# EAGLE schematic ife_19_Accumulator_BMS_v1 (EAGLE 9.0.1)

## Sheet 1 of 5: Power
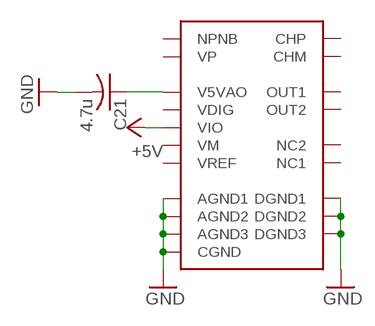
[diagram p0: schematic, sheet 1]

### Parts
C21  4.7u  C-USC0805  [C0805]
U$1  BQ76PL455A  [TQFP80]

### Nets
+5V: U$1.41(VIO) ; also sheet 4,5
GND: C21.2 U$1.30(DGND1) U$1.35(DGND2) U$1.37(DGND3) U$1.48(CGND) U$1.69(AGND3) U$1.72(AGND2) U$1.74(AGND1) ; also sheet 2,3,4,5
N$39: C21.1 U$1.58(V5VAO)
Unconnected: U$1.31(VM) U$1.32(CHP) U$1.33(CHM) U$1.34(VDIG) U$1.36(NC1) U$1.67(VREF) U$1.68(OUT2) U$1.70(VP) U$1.71(NPNB) U$1.73(OUT1) U$1.75(NC2)

## Sheet 2 of 5: Cells
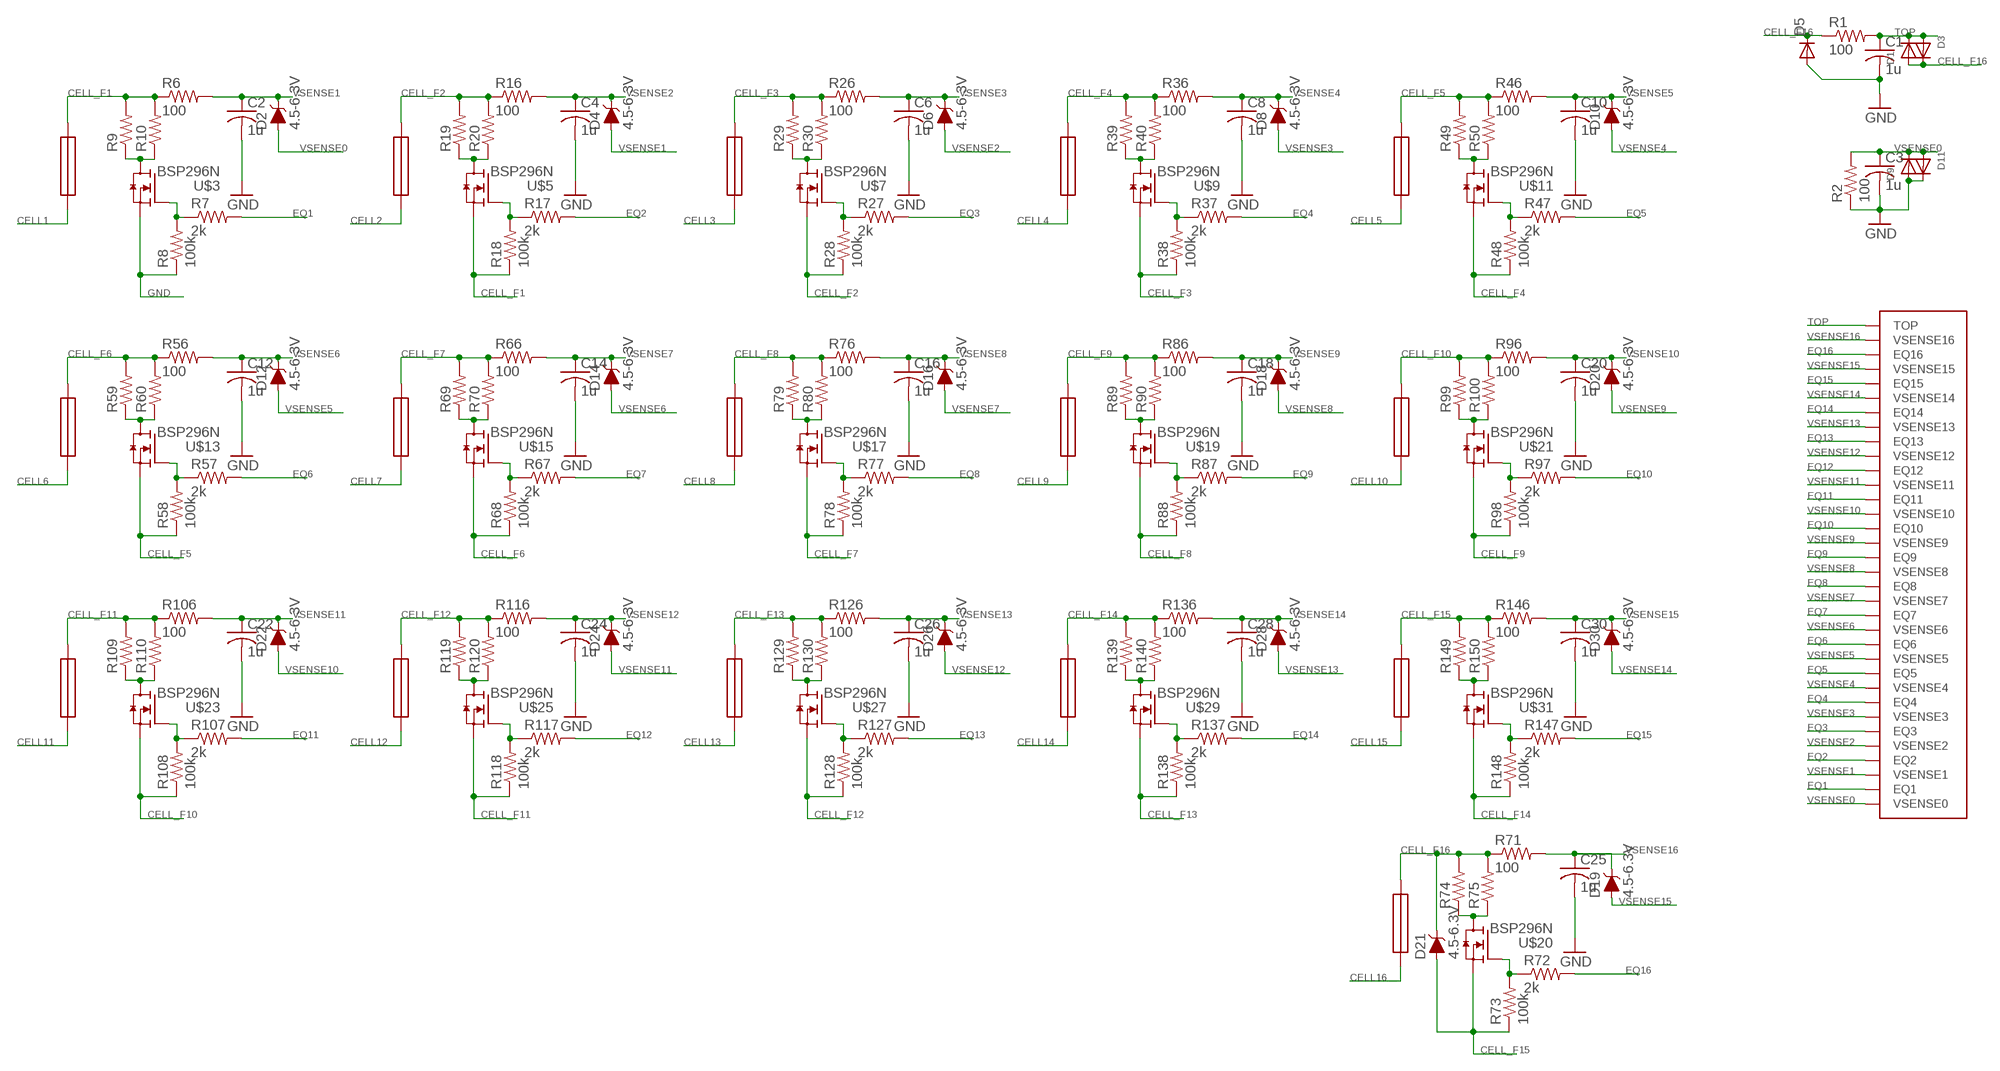
[diagram p1: schematic, sheet 2]

### Parts
C1  1u  C-USC0603K  [C0603K]
C2  1u  C-USC0603K  [C0603K]
C3  1u  C-USC0603K  [C0603K]
C4  1u  C-USC0603K  [C0603K]
C6  1u  C-USC0603K  [C0603K]
C8  1u  C-USC0603K  [C0603K]
C10  1u  C-USC0603K  [C0603K]
C12  1u  C-USC0603K  [C0603K]
C14  1u  C-USC0603K  [C0603K]
C16  1u  C-USC0603K  [C0603K]
C18  1u  C-USC0603K  [C0603K]
C20  1u  C-USC0603K  [C0603K]
C22  1u  C-USC0603K  [C0603K]
C24  1u  C-USC0603K  [C0603K]
C25  1u  C-USC0603K  [C0603K]
C26  1u  C-USC0603K  [C0603K]
C28  1u  C-USC0603K  [C0603K]
C30  1u  C-USC0603K  [C0603K]
D1  DIODESOD-123  [SOD-123]
D2  4.5-6.3V  DIODE-ZENER-MMSZ5232BS  [SOD-323]
D3  DIODESOD-123  [SOD-123]
D4  4.5-6.3V  DIODE-ZENER-MMSZ5232BS  [SOD-323]
D5  DIODE-DO214AC  [DO214AC]
D6  4.5-6.3V  DIODE-ZENER-MMSZ5232BS  [SOD-323]
D8  4.5-6.3V  DIODE-ZENER-MMSZ5232BS  [SOD-323]
D9  DIODESOD-123  [SOD-123]
D10  4.5-6.3V  DIODE-ZENER-MMSZ5232BS  [SOD-323]
D11  DIODESOD-123  [SOD-123]
D12  4.5-6.3V  DIODE-ZENER-MMSZ5232BS  [SOD-323]
D14  4.5-6.3V  DIODE-ZENER-MMSZ5232BS  [SOD-323]
D16  4.5-6.3V  DIODE-ZENER-MMSZ5232BS  [SOD-323]
D18  4.5-6.3V  DIODE-ZENER-MMSZ5232BS  [SOD-323]
D19  4.5-6.3V  DIODE-ZENER-MMSZ5232BS  [SOD-323]
D20  4.5-6.3V  DIODE-ZENER-MMSZ5232BS  [SOD-323]
D21  4.5-6.3V  DIODE-ZENER-MMSZ5232BS  [SOD-323]
D22  4.5-6.3V  DIODE-ZENER-MMSZ5232BS  [SOD-323]
D24  4.5-6.3V  DIODE-ZENER-MMSZ5232BS  [SOD-323]
D26  4.5-6.3V  DIODE-ZENER-MMSZ5232BS  [SOD-323]
D28  4.5-6.3V  DIODE-ZENER-MMSZ5232BS  [SOD-323]
D30  4.5-6.3V  DIODE-ZENER-MMSZ5232BS  [SOD-323]
FUSE1  2A  SSQC/SSTC  [0.36"X0.15"]
FUSE2  2A  SSQC/SSTC  [0.36"X0.15"]
FUSE3  2A  SSQC/SSTC  [0.36"X0.15"]
FUSE5  2A  SSQC/SSTC  [0.36"X0.15"]
FUSE7  2A  SSQC/SSTC  [0.36"X0.15"]
FUSE9  2A  SSQC/SSTC  [0.36"X0.15"]
FUSE11  2A  SSQC/SSTC  [0.36"X0.15"]
FUSE13  2A  SSQC/SSTC  [0.36"X0.15"]
FUSE15  2A  SSQC/SSTC  [0.36"X0.15"]
FUSE17  2A  SSQC/SSTC  [0.36"X0.15"]
FUSE19  2A  SSQC/SSTC  [0.36"X0.15"]
FUSE21  2A  SSQC/SSTC  [0.36"X0.15"]
FUSE23  2A  SSQC/SSTC  [0.36"X0.15"]
FUSE25  2A  SSQC/SSTC  [0.36"X0.15"]
FUSE27  2A  SSQC/SSTC  [0.36"X0.15"]
FUSE29  2A  SSQC/SSTC  [0.36"X0.15"]
R1  100  R-US_R0603  [R0603]
R2  100  R-US_R0603  [R0603]
R6  100  R-US_R0603  [R0603]
R7  2k  R-US_R0603  [R0603]
R8  100k  R-US_R0603  [R0603]
R9  R-US_R2512  [R2512]
R10  R-US_R2512  [R2512]
R16  100  R-US_R0603  [R0603]
R17  2k  R-US_R0603  [R0603]
R18  100k  R-US_R0603  [R0603]
R19  R-US_R2512  [R2512]
R20  R-US_R2512  [R2512]
R26  100  R-US_R0603  [R0603]
R27  2k  R-US_R0603  [R0603]
R28  100k  R-US_R0603  [R0603]
R29  R-US_R2512  [R2512]
R30  R-US_R2512  [R2512]
R36  100  R-US_R0603  [R0603]
R37  2k  R-US_R0603  [R0603]
R38  100k  R-US_R0603  [R0603]
R39  R-US_R2512  [R2512]
R40  R-US_R2512  [R2512]
R46  100  R-US_R0603  [R0603]
R47  2k  R-US_R0603  [R0603]
R48  100k  R-US_R0603  [R0603]
R49  R-US_R2512  [R2512]
R50  R-US_R2512  [R2512]
R56  100  R-US_R0603  [R0603]
R57  2k  R-US_R0603  [R0603]
R58  100k  R-US_R0603  [R0603]
R59  R-US_R2512  [R2512]
R60  R-US_R2512  [R2512]
R66  100  R-US_R0603  [R0603]
R67  2k  R-US_R0603  [R0603]
R68  100k  R-US_R0603  [R0603]
R69  R-US_R2512  [R2512]
R70  R-US_R2512  [R2512]
R71  100  R-US_R0603  [R0603]
R72  2k  R-US_R0603  [R0603]
R73  100k  R-US_R0603  [R0603]
R74  R-US_R2512  [R2512]
R75  R-US_R2512  [R2512]
R76  100  R-US_R0603  [R0603]
R77  2k  R-US_R0603  [R0603]
R78  100k  R-US_R0603  [R0603]
R79  R-US_R2512  [R2512]
R80  R-US_R2512  [R2512]
R86  100  R-US_R0603  [R0603]
R87  2k  R-US_R0603  [R0603]
R88  100k  R-US_R0603  [R0603]
R89  R-US_R2512  [R2512]
R90  R-US_R2512  [R2512]
R96  100  R-US_R0603  [R0603]
R97  2k  R-US_R0603  [R0603]
R98  100k  R-US_R0603  [R0603]
R99  R-US_R2512  [R2512]
R100  R-US_R2512  [R2512]
R106  100  R-US_R0603  [R0603]
R107  2k  R-US_R0603  [R0603]
R108  100k  R-US_R0603  [R0603]
R109  R-US_R2512  [R2512]
R110  R-US_R2512  [R2512]
R116  100  R-US_R0603  [R0603]
R117  2k  R-US_R0603  [R0603]
R118  100k  R-US_R0603  [R0603]
R119  R-US_R2512  [R2512]
R120  R-US_R2512  [R2512]
R126  100  R-US_R0603  [R0603]
R127  2k  R-US_R0603  [R0603]
R128  100k  R-US_R0603  [R0603]
R129  R-US_R2512  [R2512]
R130  R-US_R2512  [R2512]
R136  100  R-US_R0603  [R0603]
R137  2k  R-US_R0603  [R0603]
R138  100k  R-US_R0603  [R0603]
R139  R-US_R2512  [R2512]
R140  R-US_R2512  [R2512]
R146  100  R-US_R0603  [R0603]
R147  2k  R-US_R0603  [R0603]
R148  100k  R-US_R0603  [R0603]
R149  R-US_R2512  [R2512]
R150  R-US_R2512  [R2512]
U$3  BSP296N  [PG-SOT-223]
U$5  BSP296N  [PG-SOT-223]
U$7  BSP296N  [PG-SOT-223]
U$9  BSP296N  [PG-SOT-223]
U$11  BSP296N  [PG-SOT-223]
U$13  BSP296N  [PG-SOT-223]
U$15  BSP296N  [PG-SOT-223]
U$17  BSP296N  [PG-SOT-223]
U$19  BSP296N  [PG-SOT-223]
U$20  BSP296N  [PG-SOT-223]
U$21  BSP296N  [PG-SOT-223]
U$23  BSP296N  [PG-SOT-223]
U$25  BSP296N  [PG-SOT-223]
U$27  BSP296N  [PG-SOT-223]
U$29  BSP296N  [PG-SOT-223]
U$31  BSP296N  [PG-SOT-223]

### Nets
CELL1: FUSE1.P$1
CELL2: FUSE3.P$1
CELL3: FUSE5.P$1
CELL4: FUSE7.P$1
CELL5: FUSE9.P$1
CELL6: FUSE11.P$1
CELL7: FUSE13.P$1
CELL8: FUSE15.P$1
CELL9: FUSE17.P$1
CELL10: FUSE19.P$1
CELL11: FUSE21.P$1
CELL12: FUSE23.P$1
CELL13: FUSE25.P$1
CELL14: FUSE27.P$1
CELL15: FUSE29.P$1
CELL16: FUSE2.P$1
CELL_F1: FUSE1.P$2 R6.1 R9.2 R10.2 R18.1 U$5.3(S)
CELL_F2: FUSE3.P$2 R16.1 R19.2 R20.2 R28.1 U$7.3(S)
CELL_F3: FUSE5.P$2 R26.1 R29.2 R30.2 R38.1 U$9.3(S)
CELL_F4: FUSE7.P$2 R36.1 R39.2 R40.2 R48.1 U$11.3(S)
CELL_F5: FUSE9.P$2 R46.1 R49.2 R50.2 R58.1 U$13.3(S)
CELL_F6: FUSE11.P$2 R56.1 R59.2 R60.2 R68.1 U$15.3(S)
CELL_F7: FUSE13.P$2 R66.1 R69.2 R70.2 R78.1 U$17.3(S)
CELL_F8: FUSE15.P$2 R76.1 R79.2 R80.2 R88.1 U$19.3(S)
CELL_F9: FUSE17.P$2 R86.1 R89.2 R90.2 R98.1 U$21.3(S)
CELL_F10: FUSE19.P$2 R96.1 R99.2 R100.2 R108.1 U$23.3(S)
CELL_F11: FUSE21.P$2 R106.1 R109.2 R110.2 R118.1 U$25.3(S)
CELL_F12: FUSE23.P$2 R116.1 R119.2 R120.2 R128.1 U$27.3(S)
CELL_F13: FUSE25.P$2 R126.1 R129.2 R130.2 R138.1 U$29.3(S)
CELL_F14: FUSE27.P$2 R136.1 R139.2 R140.2 R148.1 U$31.3(S)
CELL_F15: D21.A FUSE29.P$2 R73.1 R146.1 R149.2 R150.2 U$20.3(S)
CELL_F16: D1.A D3.C D5.C D21.C FUSE2.P$2 R1.1 R71.1 R74.2 R75.2
EQ1: R7.2 U$1.28(EQ1)
EQ2: R17.2 U$1.26(EQ2)
EQ3: R27.2 U$1.24(EQ3)
EQ4: R37.2 U$1.22(EQ4)
EQ5: R47.2 U$1.20(EQ5)
EQ6: R57.2 U$1.18(EQ6)
EQ7: R67.2 U$1.16(EQ7)
EQ8: R77.2 U$1.14(EQ8)
EQ9: R87.2 U$1.12(EQ9)
EQ10: R97.2 U$1.10(EQ10)
EQ11: R107.2 U$1.8(EQ11)
EQ12: R117.2 U$1.6(EQ12)
EQ13: R127.2 U$1.4(EQ13)
EQ14: R137.2 U$1.2(EQ14)
EQ15: R147.2 U$1.80(EQ15)
EQ16: R72.2 U$1.78(EQ16)
GATE1: R7.1 R8.2 U$3.1(G)
GATE2: R17.1 R18.2 U$5.1(G)
GATE3: R27.1 R28.2 U$7.1(G)
GATE4: R37.1 R38.2 U$9.1(G)
GATE5: R47.1 R48.2 U$11.1(G)
GATE6: R57.1 R58.2 U$13.1(G)
GATE7: R67.1 R68.2 U$15.1(G)
GATE8: R77.1 R78.2 U$17.1(G)
GATE9: R87.1 R88.2 U$19.1(G)
GATE10: R97.1 R98.2 U$21.1(G)
GATE11: R107.1 R108.2 U$23.1(G)
GATE12: R117.1 R118.2 U$25.1(G)
GATE13: R127.1 R128.2 U$27.1(G)
GATE14: R137.1 R138.2 U$29.1(G)
GATE15: R147.1 R148.2 U$31.1(G)
GATE16: R72.1 R73.2 U$20.1(G)
GND: C1.2 C2.2 C3.2 C4.2 C6.2 C8.2 C10.2 C12.2 C14.2 C16.2 C18.2 C20.2 C22.2 C24.2 C25.2 C26.2 C28.2 C30.2 D5.A D9.A D11.C R2.1 R8.1 U$3.3(S) ; also sheet 1,3,4,5
N$32: R9.1 R10.1 U$3.2(D) U$3.4(D)
N$34: R19.1 R20.1 U$5.2(D) U$5.4(D)
N$36: R29.1 R30.1 U$7.2(D) U$7.4(D)
N$38: R39.1 R40.1 U$9.2(D) U$9.4(D)
N$40: R49.1 R50.1 U$11.2(D) U$11.4(D)
N$42: R59.1 R60.1 U$13.2(D) U$13.4(D)
N$43: R74.1 R75.1 U$20.2(D) U$20.4(D)
N$44: R69.1 R70.1 U$15.2(D) U$15.4(D)
N$47: R79.1 R80.1 U$17.2(D) U$17.4(D)
N$50: R89.1 R90.1 U$19.2(D) U$19.4(D)
N$54: R99.1 R100.1 U$21.2(D) U$21.4(D)
N$58: R109.1 R110.1 U$23.2(D) U$23.4(D)
N$62: R119.1 R120.1 U$25.2(D) U$25.4(D)
N$66: R129.1 R130.1 U$27.2(D) U$27.4(D)
N$70: R139.1 R140.1 U$29.2(D) U$29.4(D)
N$74: R149.1 R150.1 U$31.2(D) U$31.4(D)
TOP: C1.1 D1.C D3.A R1.2 U$1.76(TOP)
VSENSE0: C3.1 D2.A D9.C D11.A R2.2 U$1.29(VSENSE0)
VSENSE1: C2.1 D2.C D4.A R6.2 U$1.27(VSENSE1)
VSENSE2: C4.1 D4.C D6.A R16.2 U$1.25(VSENSE2)
VSENSE3: C6.1 D6.C D8.A R26.2 U$1.23(VSENSE3)
VSENSE4: C8.1 D8.C D10.A R36.2 U$1.21(VSENSE4)
VSENSE5: C10.1 D10.C D12.A R46.2 U$1.19(VSENSE5)
VSENSE6: C12.1 D12.C D14.A R56.2 U$1.17(VSENSE6)
VSENSE7: C14.1 D14.C D16.A R66.2 U$1.15(VSENSE7)
VSENSE8: C16.1 D16.C D18.A R76.2 U$1.13(VSENSE8)
VSENSE9: C18.1 D18.C D20.A R86.2 U$1.11(VSENSE9)
VSENSE10: C20.1 D20.C D22.A R96.2 U$1.9(VSENSE10)
VSENSE11: C22.1 D22.C D24.A R106.2 U$1.7(VSENSE11)
VSENSE12: C24.1 D24.C D26.A R116.2 U$1.5(VSENSE12)
VSENSE13: C26.1 D26.C D28.A R126.2 U$1.3(VSENSE13)
VSENSE14: C28.1 D28.C D30.A R136.2 U$1.1(VSENSE14)
VSENSE15: C30.1 D19.A D30.C R146.2 U$1.79(VSENSE15)
VSENSE16: C25.1 D19.C R71.2 U$1.77(VSENSE16)

## Sheet 3 of 5: Differential communication
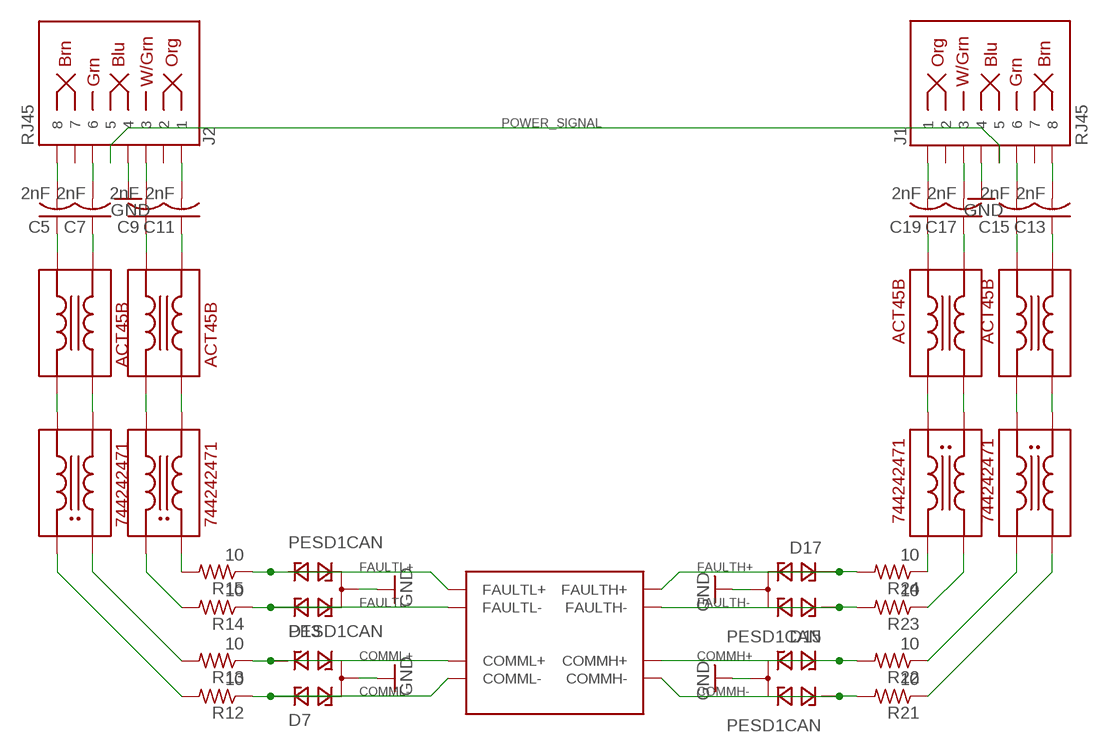
[diagram p2: schematic, sheet 3]

### Parts
C5  2nF  C-USC0805  [C0805]
C7  2nF  C-USC0805  [C0805]
C9  2nF  C-USC0805  [C0805]
C11  2nF  C-USC0805  [C0805]
C13  2nF  C-USC0805  [C0805]
C15  2nF  C-USC0805  [C0805]
C17  2nF  C-USC0805  [C0805]
C19  2nF  C-USC0805  [C0805]
D7  PESD1CAN  [SOT23]
D13  PESD1CAN  [SOT23]
D15  PESD1CAN  [SOT23]
D17  PESD1CAN  [SOT23]
J1  RJ45  RJ45-8  [RJ45-8]
J2  RJ45  RJ45-8  [RJ45-8]
R12  10  R-US_R0805  [R0805]
R13  10  R-US_R0805  [R0805]
R14  10  R-US_R0805  [R0805]
R15  10  R-US_R0805  [R0805]
R21  10  R-US_R0805  [R0805]
R22  10  R-US_R0805  [R0805]
R23  10  R-US_R0805  [R0805]
R24  10  R-US_R0805  [R0805]
U$2  ACT45B  [1812-4]
U$4  ACT45B  [1812-4]
U$6  ACT45B  [1812-4]
U$8  ACT45B  [1812-4]
U$10  WURTH-744242471  [744242471]
U$12  WURTH-744242471  [744242471]
U$14  WURTH-744242471  [744242471]
U$16  WURTH-744242471  [744242471]

### Nets
COMMH+: D15.1 R22.2 U$1.55(COMMH+)
COMMH-: D15.2 R21.2 U$1.54(COMMH-)
COMML+: D7.2 R13.1 U$1.52(COMML+)
COMML-: D7.1 R12.1 U$1.53(COMML-)
FAULTH+: D17.1 R24.2 U$1.57(FAULTH+)
FAULTH-: D17.2 R23.2 U$1.56(FAULTH-)
FAULTL+: D13.2 R15.1 U$1.50(FAULTL+)
FAULTL-: D13.1 R14.1 U$1.51(FAULTL-)
GND: D7.3 D13.3 D15.3 D17.3 J1.4 J2.4 ; also sheet 1,2,4,5
N$1: C5.1 U$6.P$4
N$2: C7.1 U$6.P$3
N$3: C9.1 U$8.P$4
N$4: C11.1 U$8.P$3
N$7: C13.1 U$2.P$2
N$8: C15.1 U$2.P$1
N$9: C17.1 U$4.P$2
N$10: C19.1 U$4.P$1
N$11: U$2.P$3 U$14.2
N$12: U$2.P$4 U$14.1
N$13: U$4.P$3 U$16.2
N$14: U$4.P$4 U$16.1
N$15: U$6.P$1 U$10.3
N$16: U$6.P$2 U$10.4
N$17: U$8.P$1 U$12.3
N$18: U$8.P$2 U$12.4
N$19: R14.2 U$12.1
N$20: R13.2 U$10.2
N$21: R12.2 U$10.1
N$22: R15.2 U$12.2
N$23: R23.1 U$16.4
N$24: R22.1 U$14.3
N$25: R21.1 U$14.4
N$26: R24.1 U$16.3
N$27: C5.2 J2.8
N$28: C7.2 J2.6
N$29: C9.2 J2.3
N$30: C11.2 J2.1
N$31: C13.2 J1.8
N$33: C15.2 J1.6
N$35: C17.2 J1.3
N$37: C19.2 J1.1
POWER_SIGNAL: J1.5 J2.5
Unconnected: J1.2 J1.7 J2.2 J2.7

## Sheet 4 of 5: Communication
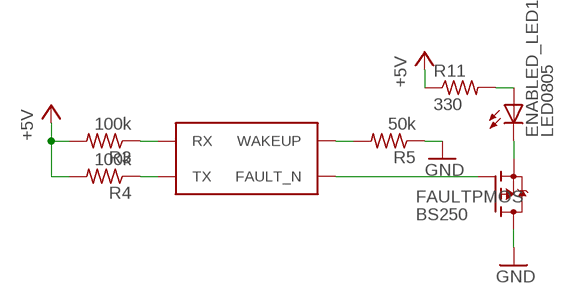
[diagram p3: schematic, sheet 4]

### Parts
ENABLED_LED1  LED0805  [LED0805]
FAULTPMOS  BS250  [SOT23]
R3  100k  R-US_R0805  [R0805]
R4  100k  R-US_R0805  [R0805]
R5  50k  R-US_R0805  [R0805]
R11  330  R-US_R0805  [R0805]

### Nets
+5V: R3.2 R4.2 R11.1 ; also sheet 1,5
FAULT_N: FAULTPMOS.1(G) U$1.40(FAULT_N)
GND: FAULTPMOS.3(D) R5.1 ; also sheet 1,2,3,5
N$5: ENABLED_LED1.2(C) FAULTPMOS.2(S)
N$6: ENABLED_LED1.1(A) R11.2
RX: R3.1 U$1.39(RX)
TX: R4.1 U$1.38(TX)
WAKEUP: R5.2 U$1.49(WAKEUP)

## Sheet 5 of 5: GPIO
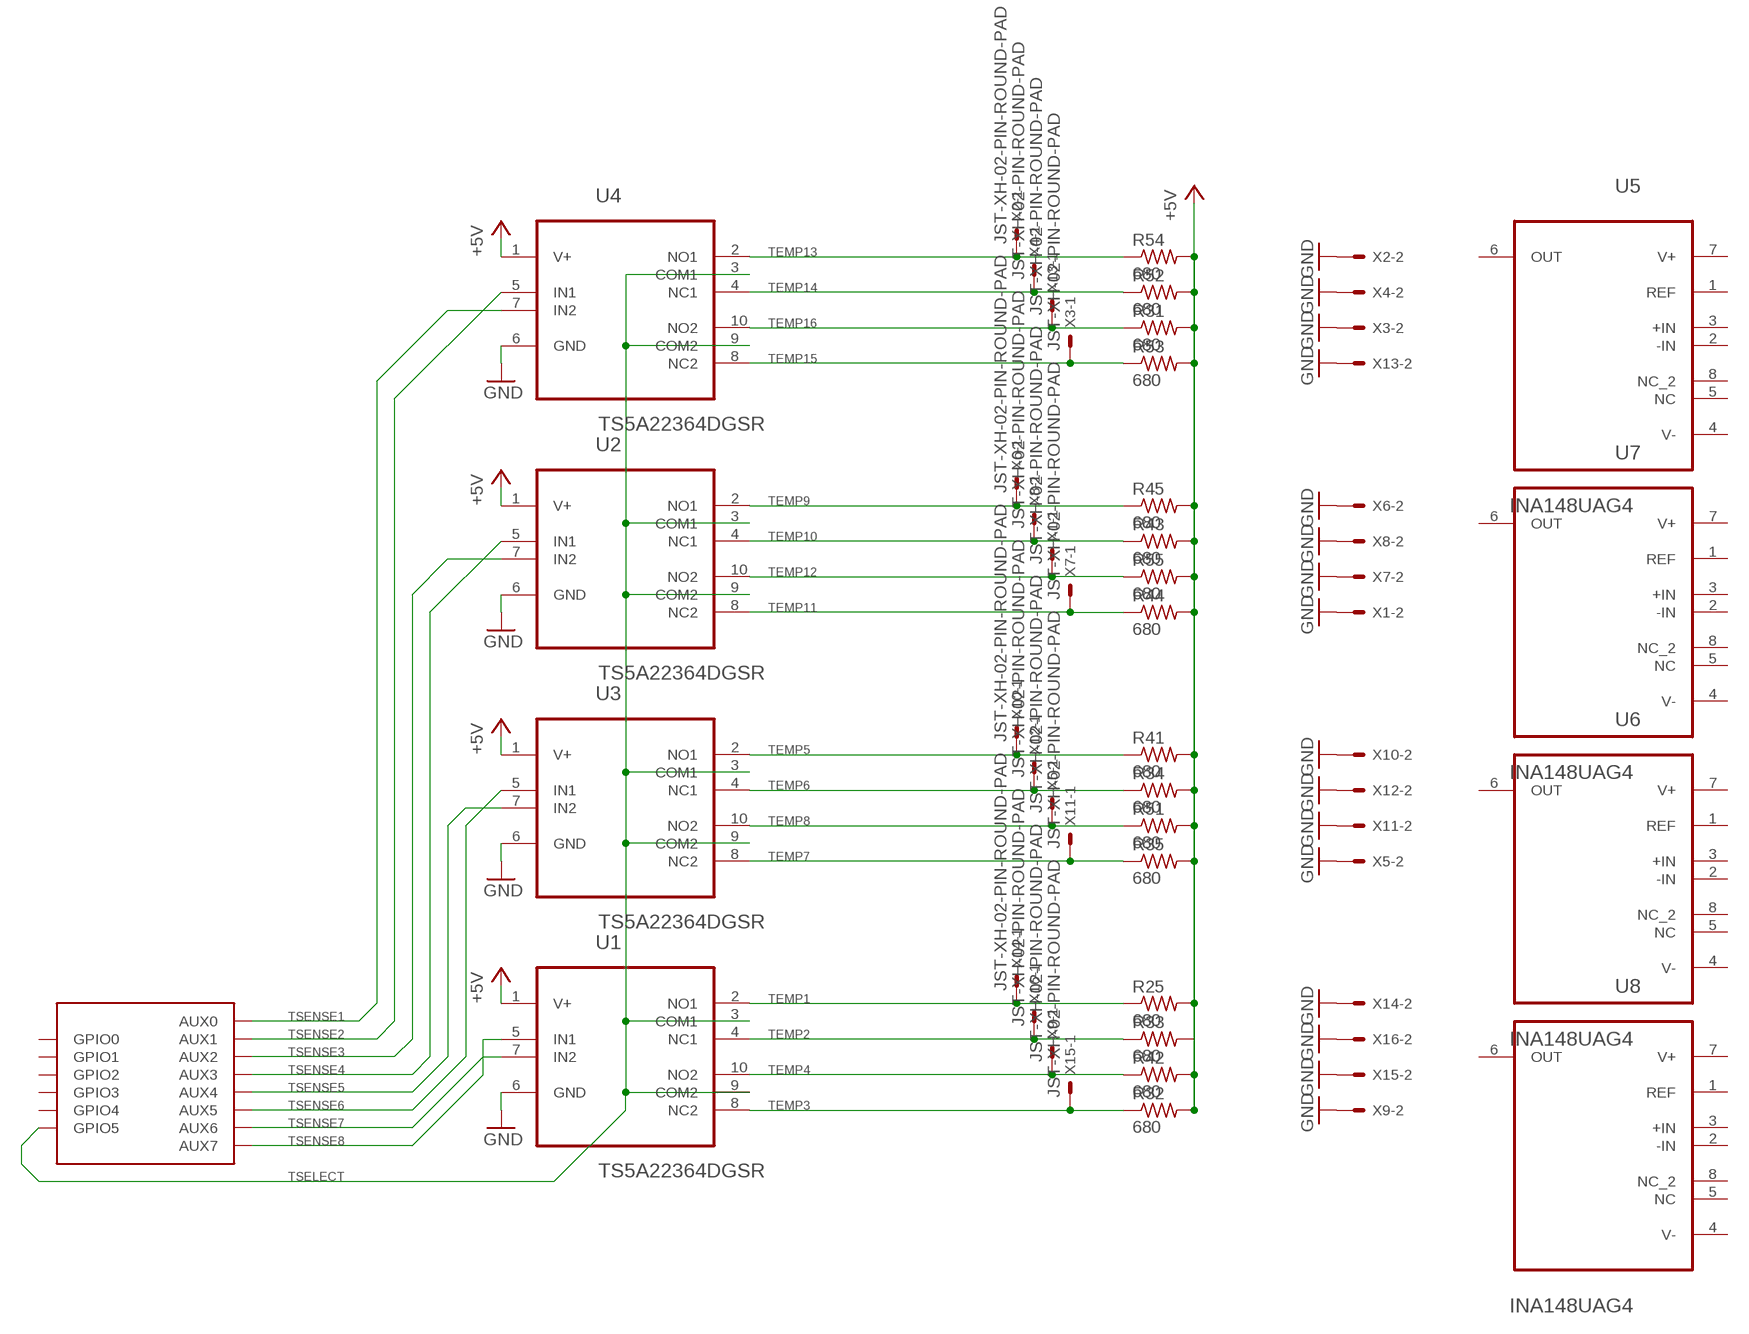
[diagram p4: schematic, sheet 5]

### Parts
R25  680  R-US_R0805  [R0805]
R31  680  R-US_R0805  [R0805]
R32  680  R-US_R0805  [R0805]
R33  680  R-US_R0805  [R0805]
R34  680  R-US_R0805  [R0805]
R35  680  R-US_R0805  [R0805]
R41  680  R-US_R0805  [R0805]
R42  680  R-US_R0805  [R0805]
R43  680  R-US_R0805  [R0805]
R44  680  R-US_R0805  [R0805]
R45  680  R-US_R0805  [R0805]
R51  680  R-US_R0805  [R0805]
R52  680  R-US_R0805  [R0805]
R53  680  R-US_R0805  [R0805]
R54  680  R-US_R0805  [R0805]
R55  680  R-US_R0805  [R0805]
U1  TS5A22364DGSR  [SOP50P490X110-10N]
U2  TS5A22364DGSR  [SOP50P490X110-10N]
U3  TS5A22364DGSR  [SOP50P490X110-10N]
U4  TS5A22364DGSR  [SOP50P490X110-10N]
U5  INA148UAG4  [SOIC127P600X175-8N]
U6  INA148UAG4  [SOIC127P600X175-8N]
U7  INA148UAG4  [SOIC127P600X175-8N]
U8  INA148UAG4  [SOIC127P600X175-8N]
X1  JST-XH-02-PIN-ROUND-PAD  [JST-XH-02-PACKAGE-ROUND-PAD]
X2  JST-XH-02-PIN-ROUND-PAD  [JST-XH-02-PACKAGE-ROUND-PAD]
X3  JST-XH-02-PIN-ROUND-PAD  [JST-XH-02-PACKAGE-ROUND-PAD]
X4  JST-XH-02-PIN-ROUND-PAD  [JST-XH-02-PACKAGE-ROUND-PAD]
X5  JST-XH-02-PIN-ROUND-PAD  [JST-XH-02-PACKAGE-ROUND-PAD]
X6  JST-XH-02-PIN-ROUND-PAD  [JST-XH-02-PACKAGE-ROUND-PAD]
X7  JST-XH-02-PIN-ROUND-PAD  [JST-XH-02-PACKAGE-ROUND-PAD]
X8  JST-XH-02-PIN-ROUND-PAD  [JST-XH-02-PACKAGE-ROUND-PAD]
X9  JST-XH-02-PIN-ROUND-PAD  [JST-XH-02-PACKAGE-ROUND-PAD]
X10  JST-XH-02-PIN-ROUND-PAD  [JST-XH-02-PACKAGE-ROUND-PAD]
X11  JST-XH-02-PIN-ROUND-PAD  [JST-XH-02-PACKAGE-ROUND-PAD]
X12  JST-XH-02-PIN-ROUND-PAD  [JST-XH-02-PACKAGE-ROUND-PAD]
X13  JST-XH-02-PIN-ROUND-PAD  [JST-XH-02-PACKAGE-ROUND-PAD]
X14  JST-XH-02-PIN-ROUND-PAD  [JST-XH-02-PACKAGE-ROUND-PAD]
X15  JST-XH-02-PIN-ROUND-PAD  [JST-XH-02-PACKAGE-ROUND-PAD]
X16  JST-XH-02-PIN-ROUND-PAD  [JST-XH-02-PACKAGE-ROUND-PAD]

### Nets
+5V: R25.2 R31.2 R32.2 R33.2 R34.2 R35.2 R41.2 R42.2 R43.2 R44.2 R45.2 R51.2 R52.2 R53.2 R54.2 R55.2 U1.1(V+) U2.1(V+) U3.1(V+) U4.1(V+) ; also sheet 1,4
GND: U1.6(GND) U2.6(GND) U3.6(GND) U4.6(GND) X1.2 X2.2 X3.2 X4.2 X5.2 X6.2 X7.2 X8.2 X9.2 X10.2 X11.2 X12.2 X13.2 X14.2 X15.2 X16.2 ; also sheet 1,2,3,4
TEMP1: R25.1 U1.2(NO1) X14.1
TEMP2: R33.1 U1.4(NC1) X16.1
TEMP3: R32.1 U1.8(NC2) X15.1
TEMP4: R42.1 U1.10(NO2) X9.1
TEMP5: R41.1 U3.2(NO1) X10.1
TEMP6: R34.1 U3.4(NC1) X12.1
TEMP7: R35.1 U3.8(NC2) X11.1
TEMP8: R51.1 U3.10(NO2) X5.1
TEMP9: R45.1 U2.2(NO1) X6.1
TEMP10: R43.1 U2.4(NC1) X8.1
TEMP11: R44.1 U2.8(NC2) X7.1
TEMP12: R55.1 U2.10(NO2) X1.1
TEMP13: R54.1 U4.2(NO1) X2.1
TEMP14: R52.1 U4.4(NC1) X4.1
TEMP15: R53.1 U4.8(NC2) X3.1
TEMP16: R31.1 U4.10(NO2) X13.1
TSELECT: U1.3(COM1) U1.9(COM2) U2.3(COM1) U2.9(COM2) U3.3(COM1) U3.9(COM2) U4.3(COM1) U4.9(COM2) U$1.42(GPIO5)
TSENSE1: U4.7(IN2) U$1.66(AUX0)
TSENSE2: U4.5(IN1) U$1.65(AUX1)
TSENSE3: U2.7(IN2) U$1.64(AUX2)
TSENSE4: U2.5(IN1) U$1.63(AUX3)
TSENSE5: U3.7(IN2) U$1.62(AUX4)
TSENSE6: U3.5(IN1) U$1.61(AUX5)
TSENSE7: U1.7(IN2) U$1.60(AUX6)
TSENSE8: U1.5(IN1) U$1.59(AUX7)
Unconnected: U5.1(REF) U5.2(-IN) U5.3(+IN) U5.5(NC) U5.6(OUT) U5.8(NC_2) U6.1(REF) U6.2(-IN) U6.3(+IN) U6.5(NC) U6.6(OUT) U6.8(NC_2) U7.1(REF) U7.2(-IN) U7.3(+IN) U7.5(NC) U7.6(OUT) U7.8(NC_2) U8.1(REF) U8.2(-IN) U8.3(+IN) U8.5(NC) U8.6(OUT) U8.8(NC_2) U$1.43(GPIO4) U$1.44(GPIO3) U$1.45(GPIO2) U$1.46(GPIO1) U$1.47(GPIO0)

## Power pins joined to a net without a drawn wire
V+: U5.7(V+) U6.7(V+) U7.7(V+) U8.7(V+)
V-: U5.4(V-) U6.4(V-) U7.4(V-) U8.4(V-)

## Library data of the parts
C1-C22 C24-C26 C28 C30 = rcl:C-US: CAPACITOR, American symbol; SPICEPREFIX: C
D1 D3 D9 D11 = adafruit:DIODE: Diode SMADIODE - SMA Surface Mount Package 20V 1A Schottky Diode Digikey: 641-1014-6-ND DO-1N4148 - Through Hole Small Current Diode SOD-123 20V 1 A (.5mV Vf) Schottky Diode - Digikey: MBRX120TPMSCT-ND SOD-323 10V 570mA (.38mV Vf, 3ns) Schottky Diode - Digikey: ZLLS410CT-ND SOD-523 30V 30mA Schottky Diode (RB751S-40TE61) - Digikey: RB751S-40TE61CT-ND SOT23-R/W - SOT23 Package (R = Solder Paste/Reflow Ovens, W = Hand-Soldering) BAT54Film 40V 300mA - Digikey: 497-7162-1-ND
D2 D4 D6 D8 D10 D12 D14 D16 D18-D22 D24 D26 D28 D30 = SparkFun-DiscreteSemi:DIODE-ZENER: Zener Diode A Zener diode allows current to flow from its anode to its cathode like a normal semiconductor diode, but it also permits current to flow in the reverse direction when its "Zener voltage" is reached. - WIkipedia; PROD_ID: DIO-12442; VALUE: 5.6V
D5 = diode:DIODE-: DIODE
D7 D13 D15 D17 = diode:PESD1CAN: CAN bus ESD protection diode Source: http://www.nxp.com/documents/data_sheet/PESD1CAN.pdf
ENABLED_LED1 = LEDS:LED0805
FAULTPMOS = TRANS:BS250: BS250FTA P-Channel Vgs(th) = 3.5V, Rds(on) = 14 ohm, Vds(max) = 45V
FUSE1-FUSE3 FUSE5 FUSE7 FUSE9 FUSE11 FUSE13 FUSE15 FUSE17 FUSE19 FUSE21 FUSE23 FUSE25 FUSE27 FUSE29 = Fuses_IFE:SSQC/SSTC
J1 J2 = SparkFun-Connectors:RJ45-8: RJ45 Jack - 8 pin Simple RJ45, 8-pin connection. Commonly used for Cat5, Cat5e, and Cat6 Ethernet cables. Here is the connector we sell at SparkFun: RJ45 8-Pin Connector <https://www.sparkfun.com/products/643> (PRT-00643) Datasheet <https://cdn.sparkfun.com/datasheets/Prototyping/04908.pdf> It is used on this SparkFun product: SparkFun RJ45 Breakout <https://www.sparkfun.com/products/716> (BOB-00716) Note, you may also be interested in the "MAGJACK" version of this. It is basically a RJ45 connector, but also has some status LEDs built into the connector housing. You can check that out in this library at the device named "MAGJACK.dev" and see these products online: RJ45 Ethernet MagJack-Compatible <https://www.sparkfun.com/products/8534> (PRT-08534) SparkFun RJ45 MagJack Breakout <https://www.sparkfun.com/products/13021> (BOB-13021); PROD_ID: CONN-08506; SF_ID: PRT-00643
R1-R60 R66-R80 R86-R90 R96-R100 R106-R110 R116-R120 R126-R130 R136-R140 R146-R150 = rcl:R-US_: RESISTOR, American symbol; SPICEPREFIX: R
U1-U4 = Texas Instruments_By_element14_Batch_1:TS5A22364DGSR: SPDT ANALOG SWITCHES; MPN: TS5A22364DGSR; OC_FARNELL: 1755579; OC_NEWARK: 85M0257; PACKAGE: MSOP-10; SUPPLIER: Texas Instruments
U5-U8 = Texas Instruments_By_element14_Batch_1:INA148UAG4: DIFFERENCE AMPLIFIER; MPN: INA148UAG4; OC_FARNELL: 1206902; OC_NEWARK: 97K1927; PACKAGE: SOIC-8; SUPPLIER: TI
U$1 = bq76pl455a:BQ76PL455A
U$2 U$4 U$6 U$8 = Chokes:ACT45B
U$3 U$5 U$7 U$9 U$11 U$13 U$15 U$17 U$19-U$21 U$23 U$25 U$27 U$29 U$31 = Infineon:BSP296N
U$10 U$12 U$14 U$16 = Chokes:WURTH-744242471
X1-X16 = Rembrandt Electronics - JST XH Connectors v1-0:JST-XH-02-PIN: JST XH Connector 2 Pin Wire to board connector. Pitch: 2,54 mm, (0.100") Number of pins: 2 Created by Rembrandt Electronics www.rembrandtelectronics.com